# Altium schematic sheet 24.SchDoc
size 355 x 254 mm
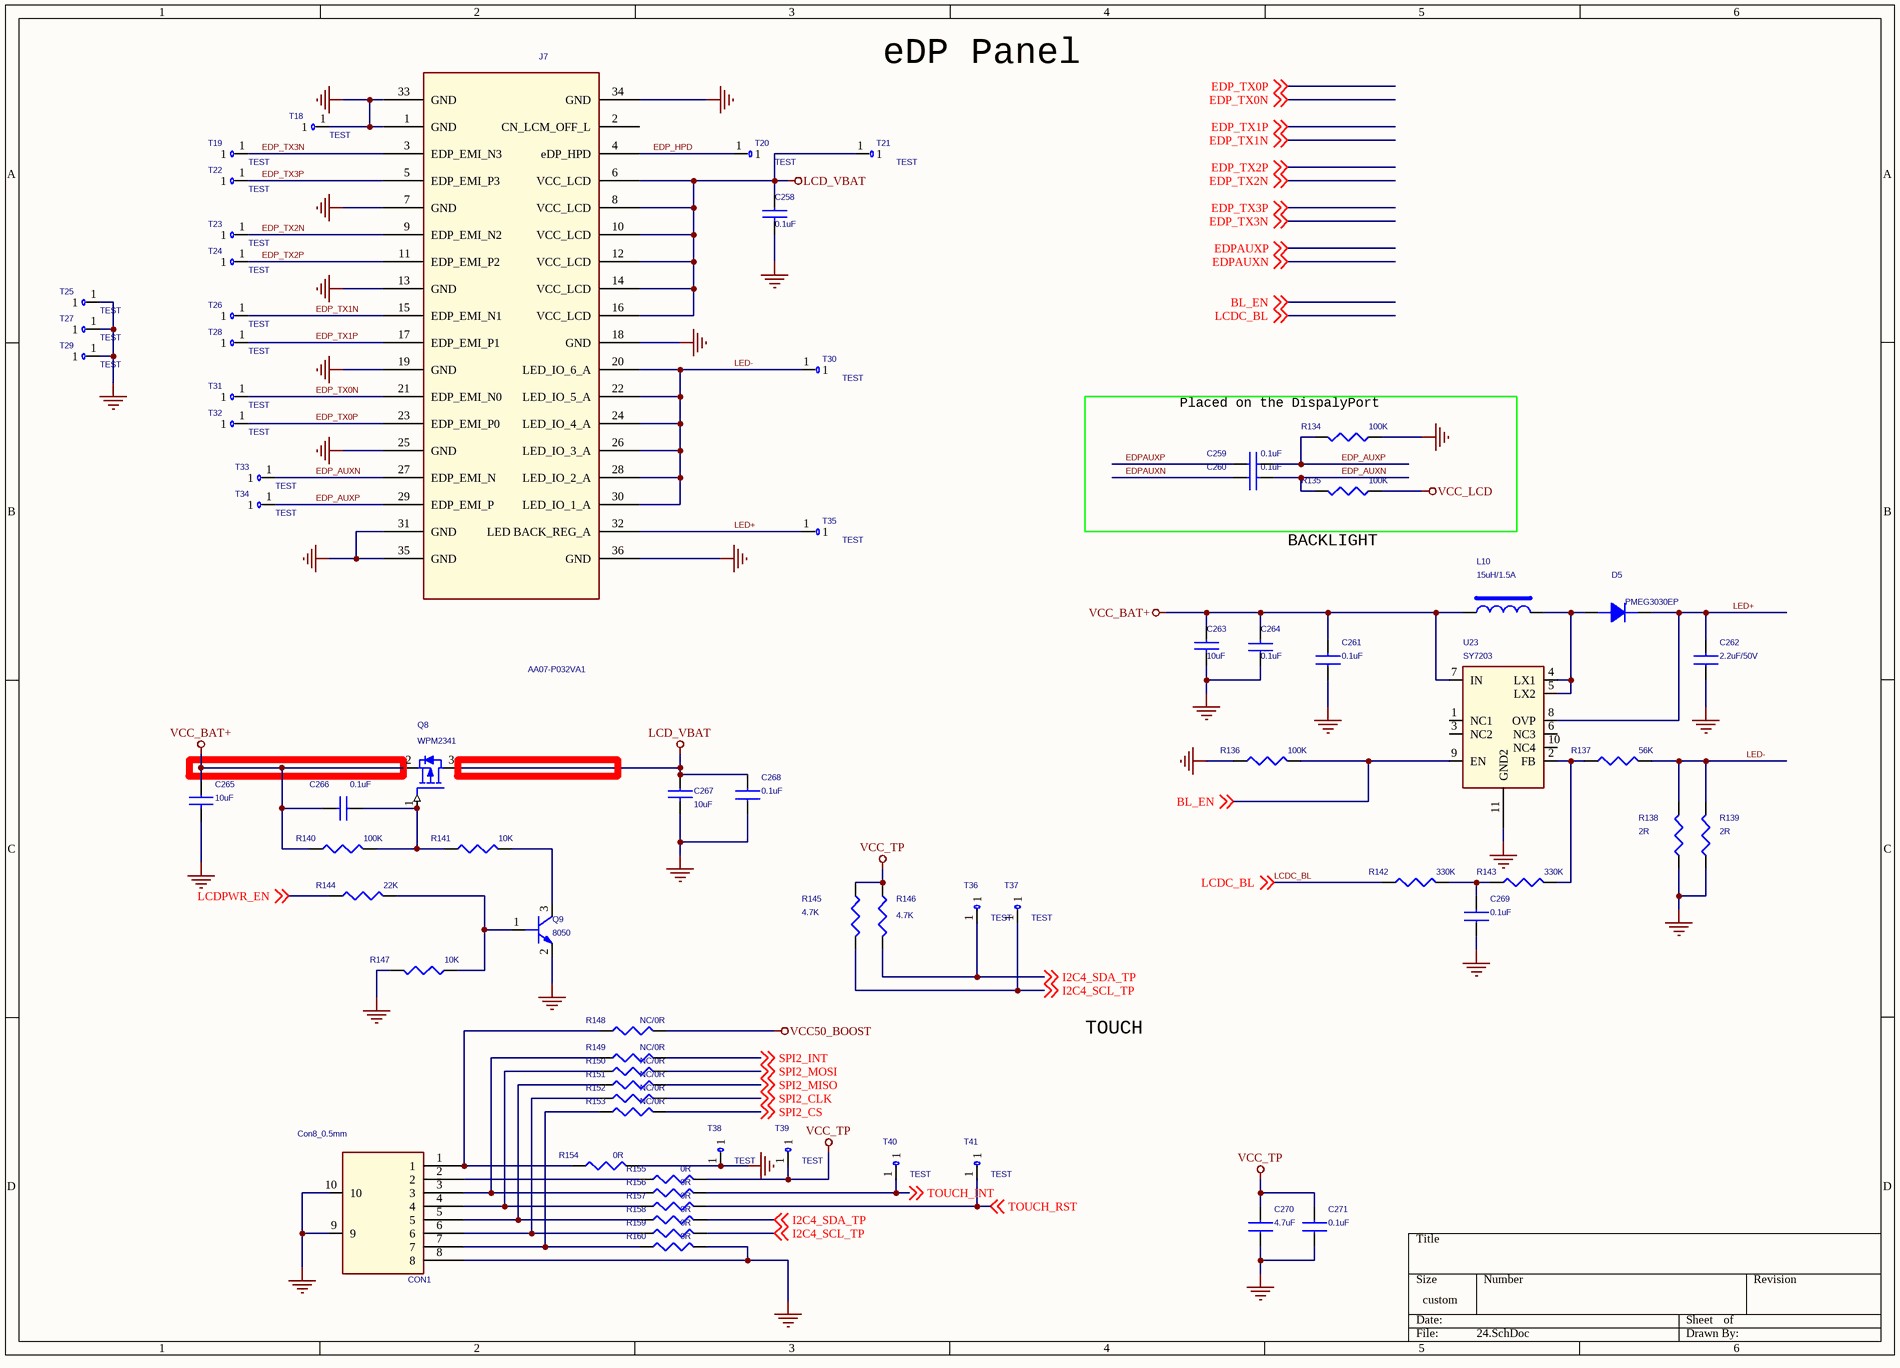
[diagram p0: 24.SchDoc]

## Parts
C258  0.1uF  [c0402]
C259  0.1uF  [c0402]
C260  0.1uF  [c0402]
C261  0.1uF  [C0603]
C262  2.2uF/50V  [C0603]
C263  10uF  [C0603]
C264  0.1uF  [C0402]
C265  10uF  [C0603]
C266  0.1uF  [C0402]
C267  10uF  [C0603]
C268  0.1uF  [C0603]
C269  0.1uF  [C0603]
C270  4.7uF  [C0603]
C271  0.1uF  [C0603]
CON1  Con8_0.5mm  [BL115H_8RL_TA14]
D5  PMEG3030EP  [SOD128]
J7  AA07-P032VA1  [AA07P032VA1N]
L10  15uH/1.5A  [IND-5X5]
Q8  WPM2341  [SOT23]
Q9  8050  [SOT23]
R134  100K  [r0402]
R135  100K  [r0402]
R136  100K  [r0402]
R137  56K  [r0402]
R138  2R  [R1206]
R139  2R  [R1206]
R140  100K  [r0402]
R141  10K  [r0402]
R142  330K  [r0402]
R143  330K  [r0402]
R144  22K  [r0402]
R145  4.7K  [R0402]
R146  4.7K  [R0402]
R147  10K  [r0402]
R148  NC/0R  [R0402]
R149  NC/0R  [R0402]
R150  NC/0R  [R0402]
R151  NC/0R  [R0402]
R152  NC/0R  [R0402]
R153  NC/0R  [R0402]
R154  0R  [R0402]
R155  0R  [R0402]
R156  0R  [R0402]
R157  0R  [R0402]
R158  0R  [R0402]
R159  0R  [R0402]
R160  0R  [R0402]
T18  TEST  [TEST]
T19  TEST  [TEST]
T20  TEST  [TEST]
T21  TEST  [TEST]
T22  TEST  [TEST]
T23  TEST  [TEST]
T24  TEST  [TEST]
T25  TEST  [TEST]
T26  TEST  [TEST]
T27  TEST  [TEST]
T28  TEST  [TEST]
T29  TEST  [TEST]
T30  TEST  [TEST]
T31  TEST  [TEST]
T32  TEST  [TEST]
T33  TEST  [TEST]
T34  TEST  [TEST]
T35  TEST  [TEST]
T36  TEST  [TEST]
T37  TEST  [TEST]
T38  TEST  [TEST]
T39  TEST  [TEST]
T40  TEST  [TEST]
T41  TEST  [TEST]
U23  SY7203  [QFN8-2X2]

## Blocks framed on the sheet
Placed on the DispalyPort: C259 C260 R134 R135

## Nets
GND: C258.2 C261.2 C262.2 C263.2 C264.1 C265.2 C267.2 C268.2 C269.1 C270.2 C271.2 CON1.8 CON1.9 CON1.10 J7.1(GND) J7.7(GND) J7.13(GND) J7.18(GND) J7.19(GND) J7.25(GND) J7.31(GND) J7.33(GND) J7.34(GND) J7.35(GND) J7.36(GND) Q9.2 R134.2 R136.1 R138.2 R139.2 R147.1 R154.2 R160.2 T18.1 T25.1 T27.1 T29.1 T38.1 U23.11(GND2)
LCD_VBAT: C258.1 C267.1 C268.1 J7.6(VCC_LCD) J7.8(VCC_LCD) J7.10(VCC_LCD) J7.12(VCC_LCD) J7.14(VCC_LCD) J7.16(VCC_LCD) Q8.3(DRAIN) T21.1
VCC50_BOOST: R148.2
VCC_BAT+: C261.1 C263.1 C264.2 C265.1 C266.2 L10.1 Q8.2(SOURCE) R140.2 U23.7(IN)
VCC_LCD: R135.2
VCC_TP: C270.1 C271.1 R145.1 R146.1 R155.2 T39.1
BL_EN: R136.2 U23.9(EN) ; off-sheet BL_EN
EDP_AUXN: C260.2 J7.27(EDP_EMI_N) R135.1 T33.1
EDP_AUXP: C259.2 J7.29(EDP_EMI_P) R134.1 T34.1
EDP_HPD: J7.4(eDP_HPD) T20.1
EDP_TX0N: J7.21(EDP_EMI_N0) T31.1 ; off-sheet EDP_TX0N
EDP_TX0P: J7.23(EDP_EMI_P0) T32.1 ; off-sheet EDP_TX0P
EDP_TX1N: J7.15(EDP_EMI_N1) T26.1 ; off-sheet EDP_TX1N
EDP_TX1P: J7.17(EDP_EMI_P1) T28.1 ; off-sheet EDP_TX1P
EDP_TX2N: J7.9(EDP_EMI_N2) T23.1 ; off-sheet EDP_TX2N
EDP_TX2P: J7.11(EDP_EMI_P2) T24.1 ; off-sheet EDP_TX2P
EDP_TX3N: J7.3(EDP_EMI_N3) T19.1 ; off-sheet EDP_TX3N
EDP_TX3P: J7.5(EDP_EMI_P3) T22.1 ; off-sheet EDP_TX3P
EDPAUXN: C260.1 ; off-sheet EDPAUXN
EDPAUXP: C259.1 ; off-sheet EDPAUXP
I2C4_SCL_TP: R145.2 R159.2 T37.1 ; off-sheet I2C4_SCL_TP
I2C4_SDA_TP: R146.2 R158.2 T36.1 ; off-sheet I2C4_SDA_TP
LCDC_BL: R142.1 ; off-sheet LCDC_BL
LCDPWR_EN: R144.2 ; off-sheet LCDPWR_EN
LED+: C262.1 D5.2(K) J7.32(LED_BACK_REG_A) T35.1 U23.8(OVP)
LED-: J7.20(LED_IO_6_A) J7.22(LED_IO_5_A) J7.24(LED_IO_4_A) J7.26(LED_IO_3_A) J7.28(LED_IO_2_A) J7.30(LED_IO_1_A) R137.2 R138.1 R139.1 T30.1
SPI2_CLK: R152.2 ; off-sheet SPI2_CLK
SPI2_CS: R153.2 ; off-sheet SPI2_CS
SPI2_INT: R149.2 ; off-sheet SPI2_INT
SPI2_MISO: R151.2 ; off-sheet SPI2_MISO
SPI2_MOSI: R150.2 ; off-sheet SPI2_MOSI
TOUCH_INT: R156.2 T40.1 ; off-sheet TOUCH_INT
TOUCH_RST: R157.2 T41.1 ; off-sheet TOUCH_RST
NetC266_1: C266.1 Q8.1(GATE) R140.1 R141.2
NetC269_2: C269.2 R142.2 R143.1
NetCON1_1: CON1.1 R148.1 R154.1
NetCON1_2: CON1.2 R155.1
NetCON1_3: CON1.3 R149.1 R156.1
NetCON1_4: CON1.4 R150.1 R157.1
NetCON1_5: CON1.5 R151.1 R158.1
NetCON1_6: CON1.6 R152.1 R159.1
NetCON1_7: CON1.7 R153.1 R160.1
NetD5_1: D5.1(A) L10.2 U23.4(LX1) U23.5(LX2)
NetQ9_1: Q9.1 R144.1 R147.2
NetQ9_3: Q9.3 R141.1
NetR137_1: R137.1 R143.2 U23.2(FB)

Not connected (* = marked no-connect by the designer): J7 2(CN_LCM_OFF_L); U23 1(NC1) 3(NC2) 6(NC3) 10(NC4)

## Notes on the sheet
- eDP Panel
- BACKLIGHT
- TOUCH

## Library data of the parts
C258-C260 = CAP NP_3: CAP,MLCC,100nF,+/-10%,X7R,6.3V,SMD0402
C261 C268 C271 = CAP NP_Dup3: CAP,MLCC,100nF,+/-10%,X7R,6.3V,SMD0402
C262 = CAP NP_Dup3: RoHS CHIP CAP 1uF +10/-10% 25V X5R
C263 = C0603
C264 = CAP NP_Dup2: RoHS CHIP CAP 1uF +10/-10% 16V X5R
C265 = CAP NP_4: RoHS CHIP CAP 22uF +10/-10% X5R
C266 = CAP NP_Dup2: NC/RoHS CHIP CAP0.1uF +10/-10% X5R
C267 = CAP NP_1_Dup1: CAP,MLCC,4.7uF,+/-10%,X5R,6.3V,SMD0603; Supplier P/N: GRM21BR61C106K; Supplier: MURATA
C269 = CAP NP_Dup3: RoHS CHIP CAP 0.1uF +10/-10% X7R
C270 = CAP NP_Dup3
CON1 = Con8_4.5mm
D5 = DIODE_Dup2
J7 = A070SN02_0.0: LCD_CON
L10 = INDUCTORS OF FERRITE
Q8 = MOSFET N_0: NC/MOSFET-P,WPM2341 ,-20V,+/-8V,-2.8A,56m Ohm@Vgs=-2.5V,44m Ohm@Vgs=-4.5V,SOT23
Q9 = NPN_0_Dup1: NC/Trans NPN,SS8050,25V,1500mA,10~60@Vce=1V,Ic=500mA, SOT-23
R134 R135 = RESISTOR_1_Dup1
R136 R142 R143 = RES 1B_Dup1: ROHS CHIP RES 4.7K 1/16W 5%
R137 = RES 1B_Dup1: ROHS CHIP RES 82K 1/16W 5%
R138 R139 = RES 1B_Dup1: ROHS CHIP RES 4.7R 1/4W 5%
R140 = RESISTOR_3: NC/ROHS CHIP RES 100K 1/16W +/-5%
R141 R147 = RESISTOR_3: NC/ROHS CHIP RES 10K 1/16W +/-5%
R144 = RESISTOR_3: NC/ROHS CHIP RES 22K 1/16W +/-5%
R145 R146 R148-R160 = RESISTOR_Dup1: ROHS CHIP RES 4.7K 1/16W 5%
T18-T41 = TEST_0
U23 = MP3202-QFN8_1